# Altium project pca10112.PrjPCB (part 3 of 5)

## Sheet pca10112_sheet6_connectors.SchDoc: Connectors
size A3; Organization: Nordic Semiconductor; DocumentNumber: 5; Revision: 2.0.0; SheetNumber: 5; SheetTotal: 8; Author: MASI; CompanyName: Nordic Semiconductor; ProjectName: pca10112.PrjPCB
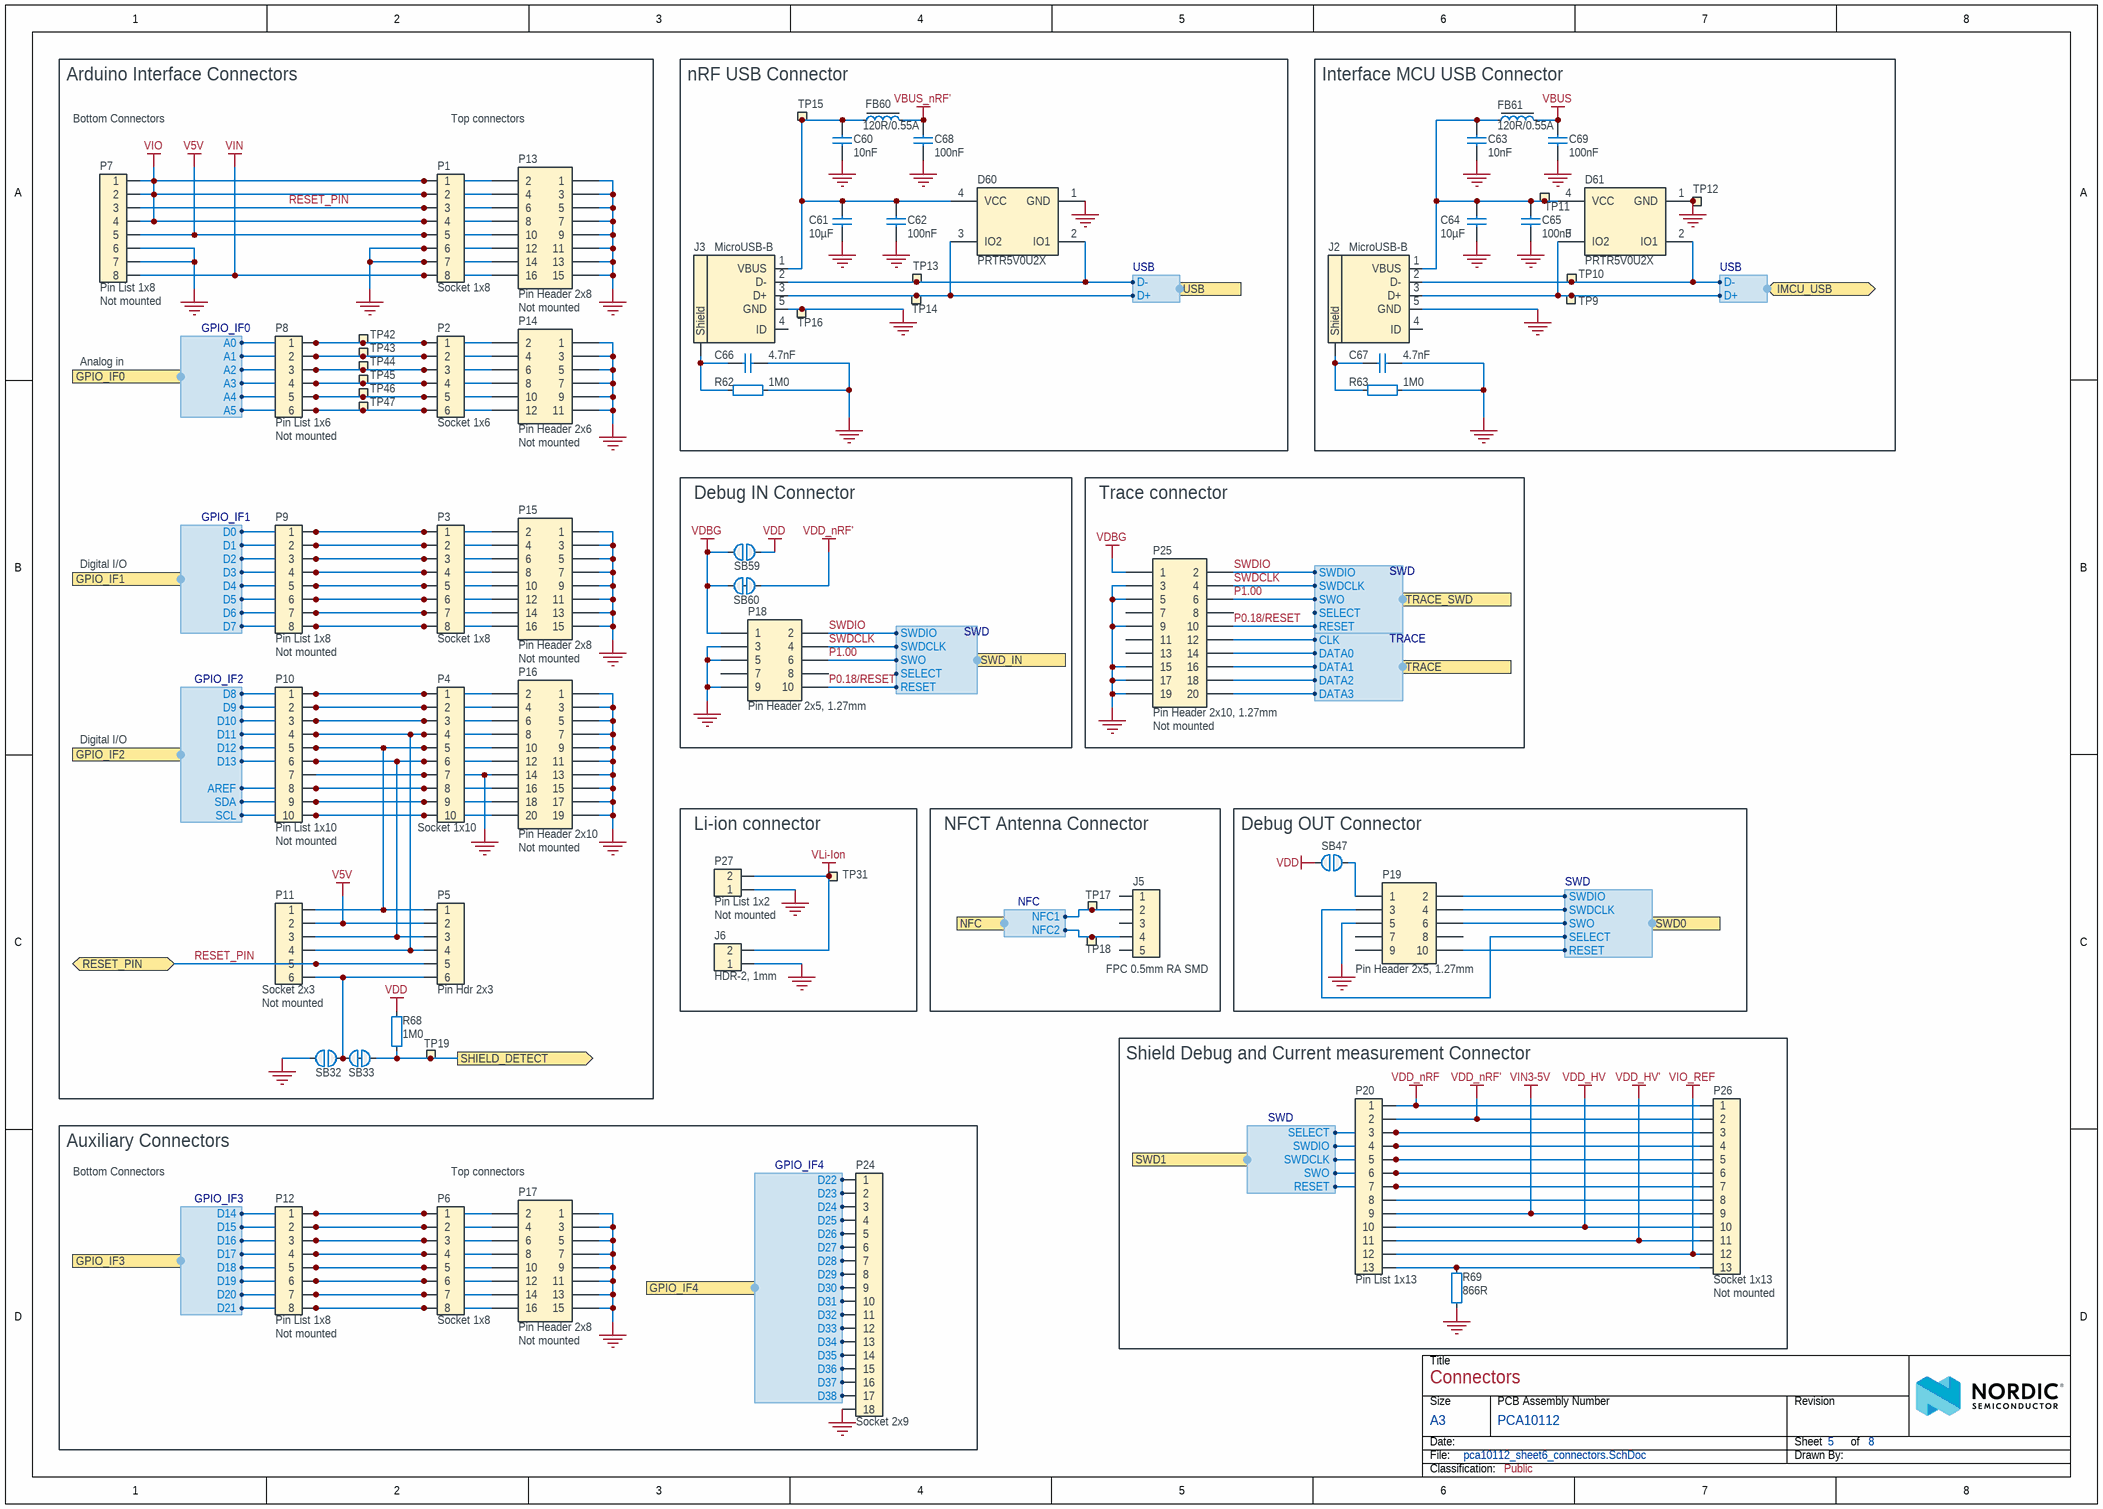
[diagram p4: pca10112_sheet6_connectors.SchDoc]

### Parts
C60  10nF  [CAPC0603X03L_C]
C61  10µF  [CAPC1608X06L]
C62  100nF  [CAPC0603X03L_C]
C63  10nF  [CAPC0603X03L_C]
C64  10µF  [CAPC1608X06L]
C65  100nF  [CAPC0603X03L_C]
C66  4.7nF  [CAPC0603X03L_C]
C67  4.7nF  [CAPC0603X03L_C]
C68  100nF  [CAPC0603X03L_C]
C69  100nF  [CAPC0603X03L_C]
D60  PRTR5V0U2X  [SOT190P230X110-4L]
D61  PRTR5V0U2X  [SOT190P230X110-4L]
FB60  120R/0.55A  [INDC1005X04L]
FB61  120R/0.55A  [INDC1005X04L]
J2  MicroUSB-B  [USB-Micro-B-RA-SMD-PiP]
J3  MicroUSB-B  [USB-Micro-B-RA-SMD-PiP]
J5  FPC 0.5mm RA SMD  [FPC_05P-0.5mm-RA-SMD]
J6  HDR-2, 1mm  [SM02B-SRSS-TB]
P1  Socket 1x8  [SOCKET_1x8_SMD]
P2  Socket 1x6  [SOCKET_1x6_SMD]
P3  Socket 1x8  [SOCKET_1x8_SMD]
P4  Socket 1x10  [SOCKET_1x10_SMD]
P5  Pin Hdr 2x3  [HDR_2x3-SMD]
P6  Socket 1x8  [SOCKET_1x8_SMD]
P7  Pin List 1x8  Assembly: Not mounted  [LIST_1x8_SMD-NC]
P8  Pin List 1x6  Assembly: Not mounted  [LIST_1x6_SMD-NC]
P9  Pin List 1x8  Assembly: Not mounted  [LIST_1x8_SMD-NC]
P10  Pin List 1x10  Assembly: Not mounted  [LIST_1x10_SMD-NC]
P11  Socket 2x3  Assembly: Not mounted  [SOCKET_2x3_SMD-2.54mm-bottom-NC]
P12  Pin List 1x8  Assembly: Not mounted  [LIST_1x8_SMD-NC]
P13  Pin Header 2x8  Assembly: Not mounted  [HDR_2x8-NC]
P14  Pin Header 2x6  Assembly: Not mounted  [HDR_2x6-NC]
P15  Pin Header 2x8  Assembly: Not mounted  [HDR_2x8-NC]
P16  Pin Header 2x10  Assembly: Not mounted  [HDR_2x10-NC]
P17  Pin Header 2x8  Assembly: Not mounted  [HDR_2x8-NC]
P18  Pin Header 2x5, 1.27mm  [HDR_2x5-SMD-1.27mm-K]
P19  Pin Header 2x5, 1.27mm  [HDR_2x5-SMD-1.27mm-K]
P20  Pin List 1x13  [LIST_1x13_SMD]
P24  Socket 2x9  [SOCKET_2x9_SMD-2.54mm]
P25  Pin Header 2x10, 1.27mm  Assembly: Not mounted  [HDR_2x10-SMD-1.27mm-NC]
P26  Socket 1x13  Assembly: Not mounted  [LIST_1x13_SMD-NC]
P27  Pin List 1x2  Assembly: Not mounted  [LIST_1x2-NC]
R62  1M0  [RESC0603X03L_C]
R63  1M0  [RESC0603X03L_C]
R68  1M0  [RESC0603X03L_C]
R69  866R  [RESC0603X03L_C]
SB32  Solderbridge  [Solderbridge]  (value not drawn)  (no BOM)
SB33  Solderbridge  [Solderbridge_Shorted]  (value not drawn)  (net tie, no BOM)
SB47  Solderbridge  [Solderbridge]  (value not drawn)  (no BOM)
SB59  Solderbridge  [Solderbridge]  (value not drawn)  (no BOM)
SB60  Solderbridge  [Solderbridge_Shorted]  (value not drawn)  (net tie, no BOM)
TP9  Ø1.0mm,SMD  [TP_SMD_D1.0mm]  (value not drawn)  (no BOM)
TP10  Ø1.0mm,SMD  [TP_SMD_D1.0mm]  (value not drawn)  (no BOM)
TP11  Ø1.0mm,SMD  [TP_SMD_D1.0mm]  (value not drawn)  (no BOM)
TP12  Ø1.0mm,SMD  [TP_SMD_D1.0mm]  (value not drawn)  (no BOM)
TP13  Ø1.5mm,SMD  [TP_SMD_D1.5mm]  (value not drawn)  (no BOM)
TP14  Ø1.5mm,SMD  [TP_SMD_D1.5mm]  (value not drawn)  (no BOM)
TP15  Ø1.5mm,SMD  [TP_SMD_D1.5mm]  (value not drawn)  (no BOM)
TP16  Ø1.5mm,SMD  [TP_SMD_D1.5mm]  (value not drawn)  (no BOM)
TP17  Ø1.0mm,SMD  [TP_SMD_D1.0mm]  (value not drawn)  (no BOM)
TP18  Ø1.0mm,SMD  [TP_SMD_D1.0mm]  (value not drawn)  (no BOM)
TP19  Ø1.0mm,SMD  [TP_SMD_D1.0mm]  (value not drawn)  (no BOM)
TP31  Ø1.0mm,SMD  [TP_SMD_D1.0mm]  (value not drawn)  (no BOM)
TP42  Ø1.0mm,SMD  [TP_SMD_D1.0mm]  (value not drawn)  (no BOM)
TP43  Ø1.0mm,SMD  [TP_SMD_D1.0mm]  (value not drawn)  (no BOM)
TP44  Ø1.0mm,SMD  [TP_SMD_D1.0mm]  (value not drawn)  (no BOM)
TP45  Ø1.0mm,SMD  [TP_SMD_D1.0mm]  (value not drawn)  (no BOM)
TP46  Ø1.0mm,SMD  [TP_SMD_D1.0mm]  (value not drawn)  (no BOM)
TP47  Ø1.0mm,SMD  [TP_SMD_D1.0mm]  (value not drawn)  (no BOM)

### Blocks framed on the sheet
Arduino Interface Connectors: P1-P5 P7-P11 P13-P16 R68 SB32 SB33 TP19 TP42-TP47
nRF USB Connector: C60-C62 C66 C68 D60 FB60 J3 R62 TP13-TP16
Interface MCU USB Connector: C63-C65 C67 C69 D61 FB61 J2 R63 TP9-TP12
Debug IN Connector: P18 SB59 SB60
Trace connector: P25
Li-ion connector: J6 P27 TP31
NFCT Antenna Connector: J5 TP17 TP18
Debug OUT Connector: P19 SB47
Shield Debug and Current measurement Connector: P20 P26 R69
Auxiliary Connectors: P6 P12 P17 P24

### Ports
GPIO_IF0 (harness GPIO_IF0), GPIO_IF1 (harness GPIO_IF1), GPIO_IF2 (harness GPIO_IF2), GPIO_IF3 (harness GPIO_IF3), GPIO_IF4 (harness GPIO_IF4), IMCU_USB (bidir, harness USB), NFC (harness NFC), RESET_PIN (bidir), SHIELD_DETECT (out), SWD0 (harness SWD), SWD1 (harness SWD), SWD_IN (harness SWD), TRACE (harness TRACE), TRACE_SWD (harness SWD), USB (harness USB)

### Harnesses
GPIO_IF0: A0, A1, A2, A3, A4, A5
GPIO_IF1: D0, D1, D2, D3, D4, D5, D6, D7
GPIO_IF2: D8, D9, D10, D11, D12, D13, AREF, SDA, SCL
GPIO_IF3: D14, D15, D16, D17, D18, D19, D20, D21
GPIO_IF4: D22, D23, D24, D25, D26, D27, D28, D29, D30, D31, D32, D33, D34, D35, D36, D37, D38
SWD: SWDIO, SWDCLK, SWO, RESET, SELECT
NFC: NFC2, NFC1
TRACE: CLK, DATA0, DATA1, DATA3, DATA2
USB: D-, D+
USB: D+, D-

### Nets
GND: C60.1 C61.1 C62.1 C63.2 C64.1 C65.1 C66.1 C67.1 C68.1 C69.1 D60.1(GND) D61.1(GND) J2.5(GND) J3.5(GND) J6.1 P1.6 P1.7 P4.7 P7.6 P7.7 P10.7 P13.1 P13.3 P13.5 P13.7 P13.9 P13.11 P13.12 P13.13 P13.14 P13.15 P14.1 P14.3 P14.5 P14.7 P14.9 P14.11 P15.1 P15.3 P15.5 P15.7 P15.9 P15.11 P15.13 P15.15 P16.1 P16.3 P16.5 P16.7 P16.9 P16.11 P16.13 P16.14 P16.15 P16.17 P16.19 P17.1 P17.3 P17.5 P17.7 P17.9 P17.11 P17.13 P17.15 P18.3 P18.5 P18.9 P19.5 P24.18 P25.3 P25.5 P25.9 P25.15 P25.17 P25.19 P27.1 R62.1 R63.1 R69.1 SB32.1 TP12.1 TP16.1
V5V: P1.5 P5.2 P7.5 P11.2 P13.10
VBUS: C69.2 FB61.2
VBUS_nRF': C68.2 FB60.2
VDBG: P18.1 P25.1 SB59.1 SB60.1
VDD: R68.2 SB47.1 SB59.2
VDD_HV: P20.10 P26.10
VDD_HV': P20.11 P26.11
VDD_nRF: P20.1 P26.1
VDD_nRF': P20.2 P26.2 SB60.2
VIN: P1.8 P7.8 P13.16
VIN3-5V: P20.9 P26.9
VIO: P1.1 P1.2 P1.4 P7.1 P7.2 P7.4 P13.2 P13.4 P13.8
VIO_REF: P20.12 P26.12
VLi-Ion: J6.2 P27.2 TP31.1
D20: P6.7 P12.7 P17.14 ; port GPIO_IF3.D20
D21: P6.8 P12.8 P17.16 ; port GPIO_IF3.D21
D_N: D60.2(IO1) J3.2(D-) TP13.1 ; port USB.D-
D_P: D60.3(IO2) J3.3(D+) TP14.1 ; port USB.D+
IMCU_N: D61.2(IO1) J2.2(D-) TP10.1 ; port IMCU_USB.D-
IMCU_P: D61.3(IO2) J2.3(D+) TP9.1 ; port IMCU_USB.D+
NFC1: J5.2 TP17.1 ; port NFC.NFC1
NFC2: J5.4 TP18.1 ; port NFC.NFC2
P0.00: P6.1 P12.1 P17.2 ; port GPIO_IF3.D14
P0.01: P6.2 P12.2 P17.4 ; port GPIO_IF3.D15
P0.02/AIN0: P4.8 P10.8 P16.16 ; port GPIO_IF2.AREF
P0.03/AIN1: P2.1 P8.1 P14.2 TP42.1 ; port GPIO_IF0.A0
P0.04/AIN2: P2.2 P8.2 P14.4 TP43.1 ; port GPIO_IF0.A1
P0.05/AIN3: P6.3 P12.3 P17.6 ; port GPIO_IF3.D16
P0.06: P6.4 P12.4 P17.8 ; port GPIO_IF3.D17
P0.07: P6.5 P12.5 P17.10 P25.12 ; port GPIO_IF3.D18, port TRACE.CLK
P0.08: P6.6 P12.6 P17.12 ; port GPIO_IF3.D19
P0.11: P24.1 P25.18 ; port GPIO_IF4.D22, port TRACE.DATA2
P0.12: P24.2 P25.16 ; port GPIO_IF4.D23, port TRACE.DATA1
P0.13: P24.3 ; port GPIO_IF4.D24
P0.14: P24.4 ; port GPIO_IF4.D25
P0.15: P24.5 ; port GPIO_IF4.D26
P0.16: P24.6 ; port GPIO_IF4.D27
P0.17: P24.7 ; port GPIO_IF4.D28
P0.18/RESET: P18.10 P24.8 P25.10 ; port GPIO_IF4.D29, port TRACE_SWD.RESET
P0.19: P24.9 ; port GPIO_IF4.D30
P0.20: P24.10 ; port GPIO_IF4.D31
P0.21: P24.11 ; port GPIO_IF4.D32
P0.22: P24.12 ; port GPIO_IF4.D33
P0.23: P24.13 ; port GPIO_IF4.D34
P0.24: P24.14 ; port GPIO_IF4.D35
P0.25: P24.15 ; port GPIO_IF4.D36
P0.28/AIN4: P2.3 P8.3 P14.6 TP44.1 ; port GPIO_IF0.A2
P0.29/AIN5: P2.4 P8.4 P14.8 TP45.1 ; port GPIO_IF0.A3
P0.30/AIN6: P2.5 P8.5 P14.10 TP46.1 ; port GPIO_IF0.A4
P0.31/AIN7: P2.6 P8.6 P14.12 TP47.1 ; port GPIO_IF0.A5
P1.00: P18.6 P24.16 P25.6 P25.14 ; port GPIO_IF4.D37, port TRACE_SWD.SWO, port TRACE.DATA0
P1.01: P3.1 P9.1 P15.2 ; port GPIO_IF1.D0
P1.02: P3.2 P9.2 P15.4 ; port GPIO_IF1.D1
P1.03: P3.3 P9.3 P15.6 ; port GPIO_IF1.D2
P1.04: P3.4 P9.4 P15.8 ; port GPIO_IF1.D3
P1.05: P3.5 P9.5 P15.10 ; port GPIO_IF1.D4
P1.06: P3.6 P9.6 P15.12 ; port GPIO_IF1.D5
P1.07: P3.7 P9.7 P15.14 ; port GPIO_IF1.D6
P1.08: P3.8 P9.8 P15.16 ; port GPIO_IF1.D7
P1.09: P24.17 P25.20 ; port GPIO_IF4.D38, port TRACE.DATA3
P1.10: P4.1 P10.1 P16.2 ; port GPIO_IF2.D8
P1.11: P4.2 P10.2 P16.4 ; port GPIO_IF2.D9
P1.12: P4.3 P10.3 P16.6 ; port GPIO_IF2.D10
P1.13: P4.4 P5.4 P10.4 P11.4 P16.8 ; port GPIO_IF2.D11
P1.14: P4.5 P5.1 P10.5 P11.1 P16.10 ; port GPIO_IF2.D12
P1.15: P4.6 P5.3 P10.6 P11.3 P16.12 ; port GPIO_IF2.D13
RESET_PIN: P1.3 P5.5 P7.3 P11.5 P13.6 ; port RESET_PIN
SCL: P4.10 P10.10 P16.20 ; port GPIO_IF2.SCL
SDA: P4.9 P10.9 P16.18 ; port GPIO_IF2.SDA
SHIELD_DETECT: R68.1 SB33.2 TP19.1 ; port SHIELD_DETECT
SWD0_SEL: P19.3 ; port SWD0.SELECT
SWDCLK: P18.4 P25.4 ; port TRACE_SWD.SWDCLK
SWDIO: P18.2 P25.2 ; port TRACE_SWD.SWDIO
NetC60_2: C60.2 C61.2 C62.2 D60.4(VCC) FB60.1 J3.1(VBUS) TP15.1
NetC63_1: C63.1 C64.2 C65.2 D61.4(VCC) FB61.1 J2.1(VBUS) TP11.1
NetC66_2: C66.2 J3.6(Shield) R62.2
NetC67_2: C67.2 J2.6(Shield) R63.2
NetP5_6: P5.6 P11.6 SB32.2 SB33.1
NetP19_1: P19.1 SB47.2
NetP19_2: P19.2 ; port SWD0.SWDIO
NetP19_4: P19.4 ; port SWD0.SWDCLK
NetP19_6: P19.6 ; port SWD0.SWO
NetP19_10: P19.10 ; port SWD0.RESET
NetP20_3: P20.3 P26.3 ; port SWD1.SELECT
NetP20_4: P20.4 P26.4 ; port SWD1.SWDIO
NetP20_5: P20.5 P26.5 ; port SWD1.SWDCLK
NetP20_6: P20.6 P26.6 ; port SWD1.SWO
NetP20_7: P20.7 P26.7 ; port SWD1.RESET
NetP20_8: P20.8 P26.8
NetP20_13: P20.13 P26.13 R69.2

Not connected (* = marked no-connect by the designer): J2 4(ID); J3 4(ID); J5 1 3 5; P18 7 8; P19 7 8 9; P25 7 8 11 13

### Notes on the sheet
- Bottom Connectors
- Top connectors
- Analog in
- Digital I/O
- Title
- Size
- Date:
- File:
- A3
- PCB Assembly Number
- Sheet         of
- Drawn By:
- Revision
- Classification:

### Library data of the parts
C60 C63 = C0201-10n: Capacitor, X7R, ±10%; Manufacturer: N.A.; Part number IPS: 00000003480; Part number Norautron: 26621779; Part number NEMS: 100200067; Note: 10V; Pad Count: 2; Component Status: Active; Part Number: C0201-10n; Manufacturer Part Number: N.A.; LatestRevisionDate: 2017-11-09; Published: 2014-11-13; Value: 10nF; Artikkelnr Noca: N.A.; Footprint Doc: 0201; ComponentLink1URL: N.A.; ComponentLink1Description: Datasheet; ComponentLink2URL: N.A.; ComponentLink2Description: Supplier link; HelpURL: N.A.; Supplier 1: N.A.; Supplier Part Number 1: N.A.; Supplier 2: N.A.; Supplier Part Number 2: N.A.; Component Class: Capacitors; PartId: 100200067; Author: rsk
C61 C64 = C0603-10µ: Capacitor, X5R, ±20%; Manufacturer: N.A.; Part number IPS: 00000007785; Part number NEMS: 100200275; Note: 6.3V; Artikkelnr Noca: 20039234; Pad Count: 2; Component Status: Active; Part Number: C0603-10µ; Manufacturer Part Number: N.A.; LatestRevisionDate: 2011-01-17; Published: 2011-01-17; Value: 10µF; Footprint Doc: 0603; ComponentLink1URL: N.A.; ComponentLink1Description: Datasheet; ComponentLink2URL: N.A.; ComponentLink2Description: Supplier link; HelpURL: N.A.; Supplier 1: N.A.; Supplier Part Number 1: N.A.; Supplier 2: N.A.; Supplier Part Number 2: N.A.; Component Class: Capacitors; PartId: 100200275; Author: rsk; Part number Norautron: N.A.
C62 C65 C68 C69 = C0201-100n: Capacitor, X5R, ±10%; Manufacturer: N.A.; Part number IPS: 00000001248, 00000002505; Part number Norautron: 262071862; Part number NEMS: 100200078; Note: 16V; Pad Count: 2; Component Status: Active; Part Number: C0201-100n; Manufacturer Part Number: N.A.; LatestRevisionDate: 2017-11-09; Published: 2014-11-13; Value: 100nF; Artikkelnr Noca: N.A.; Footprint Doc: 0201; ComponentLink1URL: N.A.; ComponentLink1Description: Datasheet; ComponentLink2URL: N.A.; ComponentLink2Description: Supplier link; HelpURL: N.A.; Supplier 1: N.A.; Supplier Part Number 1: N.A.; Supplier 2: N.A.; Supplier Part Number 2: N.A.; Component Class: Capacitors; PartId: 100200078; Author: rsk
C66 C67 = C0201-4n7: Capacitor, X7R, ±10%, 10V; Manufacturer: N.A.; Part number IPS: 00000001243; Part number NEMS: 100200063; Note: Chip Cap 1%; Pad Count: 2; Component Status: Active; Part Number: C0201-4n7; Manufacturer Part Number: N.A.; LatestRevisionDate: 2020-10-13; Published: 2014-11-13; Value: 4.7nF; Artikkelnr Noca: N.A.; Footprint Doc: 0201; ComponentLink1URL: N.A.; ComponentLink1Description: Datasheet; ComponentLink2URL: N.A.; ComponentLink2Description: Supplier link; HelpURL: N.A.; Supplier 1: N.A.; Supplier Part Number 1: N.A.; Supplier 2: N.A.; Supplier Part Number 2: N.A.; Component Class: Capacitors; PartId: 100200063; Author: rsk; Part number Norautron: N.A.
D60 D61 = PRTR5V0U2X: Ultra low capacitance double rail-to-rail ESD protection diode; Manufacturer: NXP Semiconductors; Part number IPS: 00000009951; Part number Norautron: 26313940; Part number NEMS: 101300082; Note: N.A.; Artikkelnr Noca: 10069015; Pad Count: 4; Component Status: Active; Part Number: PRTR5V0U2X; Manufacturer Part Number: PRTR5V0U2X; LatestRevisionDate: 2017-11-09; Published: 2012-06-11; Value: PRTR5V0U2X; Footprint Doc: SOT-143B; ComponentLink1URL: N.A.; ComponentLink1Description: Datasheet; ComponentLink2URL: N.A.; ComponentLink2Description: Supplier link; HelpURL: http://www.farnell.com/datasheets/109718.pdf; Supplier 1: Digi-Key; Supplier Part Number 1: 568-4140-1-ND; Supplier 2: Farnell; Supplier Part Number 2: 152-4157; Component Class: Semiconductors; PartId: 101300082; Author: rsk
FB60 FB61 = FB0402-120R@100M-500mA: Ferrite Bead, 120 Ohm @ 100MHz, 500mA, 250 mOhm Max; Manufacturer: Murata; Manufacturer Part Number: BLM15AG121SN1D; Part number IPS: 00000009954; Part number Norautron: 265230631; Part number NEMS: 100300099; Note: Chip EMIFIL Inductor Type Chip Ferrite Bead; Artikkelnr Noca: 33029317; Pad Count: 2; Component Status: Active; Part Number: FB0402-120R@100M-500mA; Footprint Doc: 0402; LatestRevisionDate: 2014-01-10; Published: 2011-11-14; Value: 120R/0.55A; ComponentLink1Description: Datasheet; ComponentLink2Description: Supplier link; ComponentLink1URL: N.A.; ComponentLink2URL: N.A.; HelpURL: http://search.murata.co.jp/Ceramy/image/img/PDF/ENG/L0110S0100BLM15A_SN.pdf; Supplier 1: Digi-Key; Supplier Part Number 1: 490-1005-1-ND; Supplier 2: Farnell; Supplier Part Number 2: 151-5760; Component Class: Inductors; PartId: 100300099; Author: rsk
J2 J3 = USB-Micro-B-RA-SMD-PiP: MicroUSB-B-SMT; Manufacturer: Allen Creations Corp.; Manufacturer Part Number: AJU55-BS2111-L; Part number IPS: 00000007790; Part number NEMS: 100500490; Note: N.A.; Artikkelnr Noca: 55029020; Pad Count: 5; Component Status: Active; Part Number: USB-Micro-B-RA-SMD-PiP; Footprint Doc: USB-Micro-B-RA-SMD-PiP; LatestRevisionDate: 2016-04-21; Published: 2014-10-07; Value: MicroUSB-B; ComponentLink1URL: N.A.; ComponentLink1Description: Datasheet; ComponentLink2URL: N.A.; ComponentLink2Description: Supplier link; HelpURL: \\hizz\pro\app9717\Datasheet\connectors\Allen Creations Corp\AJU-211.pdf; Supplier 1: Cabcon; Supplier Part Number 1: AJU55-BS2111-L; Supplier 2: Digi-Key; Supplier Part Number 2: 609-4616-1-ND; Component Class: Connectors; PartId: 100500490; Author: rsk; Part number Norautron: N.A.
J5 = FPC_05P-0.5mm-RA-SMD: 0.5mm FPC, 5P,Right Angle SMT,Double Contact,H=1.2mm,White, Tin plated; Manufacturer: W-CON; Manufacturer Part Number: 5141-05RZDNWR02; Part number IPS: 00000007792; Part number Norautron: 26032377; Part number NEMS: 100500528; Note: N.A.; Artikkelnr Noca: 55010020; Pad Count: 7; Component Status: Active; Part Number: FPC_05P-0.5mm-RA-SMD; Footprint Doc: FPC_05P-0.5mm-RA-SMD; LatestRevisionDate: 2021-09-24; Published: 2015-06-22; Value: FPC 0.5mm RA SMD; ComponentLink1URL: N.A.; ComponentLink1Description: Datasheet; ComponentLink2URL: N.A.; ComponentLink2Description: Supplier link; HelpURL: \\hizz\pro\app9717\Datasheet\connectors\W-CON\5141-05RZDNXX02.pdf; Supplier 1: Cabcon; Supplier Part Number 1: 5141-05RZDNWR02; Supplier 2: Digi-Key; Supplier Part Number 2: WM9836CT-ND; Component Class: Connectors; PartId: 100500528; Author: rsk
J6 = SM02B-SRSS-TB: 1.0mm pitch connector side entry SMD; Manufacturer: JST Sales America Inc.; Manufacturer Part Number: SM02B-SRSS-TB(LF)(SN); Part number IPS: 00000007791; Part number Norautron: N.A.; Part number NEMS: 100500383; Note: JST, Header; Artikkelnr Noca: 55010030; Pad Count: 2; Component Status: Active; Part Number: SM02B-SRSS-TB; Footprint Doc: SM02B-SRSS-TB; LatestRevisionDate: 2016-06-20; Published: 2016-06-20; Value: HDR-2, 1mm; ComponentLink1URL: N.A.; ComponentLink1Description: Datasheet; ComponentLink2URL: N.A.; ComponentLink2Description: Supplier link; HelpURL: http://www.jst-mfg.com/product/pdf/eng/eSH.pdf; Supplier 1: Cabcon; Supplier Part Number 1: SM02B-SRSS-TB(LF)(SN); Supplier 2: Digi-Key; Supplier Part Number 2: 455-1802-1-ND; Component Class: Connectors; PartId: 100500383; Author: rsk
P1 P3 P6 = Socket 1x8 SMD: Socket 1x8, 2.54mm (100mil), SMD; Manufacturer: W-CON; Manufacturer Part Number: 2171-108MS0CUNR1; Part number IPS: 00000009963; Part number Norautron: 26032369; Part number NEMS: 100500412; Note: N.A.; Artikkelnr Noca: 55030002; Pad Count: 8; Component Status: Active; Part Number: Socket 1x8 SMD; Footprint Doc: SOCKET_1x8_SMD; LatestRevisionDate: 2017-10-23; Published: 2016-01-22; Value: Socket 1x8; ComponentLink1URL: N.A.; ComponentLink1Description: Datasheet; ComponentLink2URL: N.A.; ComponentLink2Description: Supplier link; HelpURL: N.A.; Supplier 1: Cabcon; Supplier Part Number 1: 2171-108MS0CUNR1; Supplier 2: Samtec; Supplier Part Number 2: SSM-108-F-SV-P-TR; Component Class: Connectors; PartId: 100500412; Author: rsk
P2 = Socket 1x6 SMD: Socket 1x6, 2.54mm (100mil), SMD; Manufacturer: W-CON; Manufacturer Part Number: 2171-106MS0CUNR1; Part number IPS: 00000009964; Part number Norautron: 26032370; Part number NEMS: 100500408; Note: N.A.; Artikkelnr Noca: 55030001; Pad Count: 6; Component Status: Active; Part Number: Socket 1x6 SMD; Footprint Doc: SOCKET_1x6_SMD; LatestRevisionDate: 2017-10-23; Published: 2016-01-22; Value: Socket 1x6; ComponentLink1URL: N.A.; ComponentLink1Description: Datasheet; ComponentLink2URL: N.A.; ComponentLink2Description: Supplier link; HelpURL: N.A.; Supplier 1: Cabcon; Supplier Part Number 1: 2171-106MS0CUNR1; Supplier 2: Samtec; Supplier Part Number 2: SSM-106-F-SV-P-TR; Component Class: Connectors; PartId: 100500408; Author: rsk
P4 = Socket 1x10 SMD: Socket 1x10, 2.54mm (100mil), SMD; Manufacturer: W-CON; Manufacturer Part Number: 2171-110MS0CUNR1; Part number IPS: 00000009965; Part number Norautron: 26032371; Part number NEMS: 100500416; Note: N.A.; Artikkelnr Noca: 55030004; Pad Count: 10; Component Status: Active; Part Number: Socket 1x10 SMD; Footprint Doc: SOCKET_1x10_SMD; LatestRevisionDate: 2016-01-22; Published: 2016-01-22; Value: Socket 1x10; ComponentLink1URL: N.A.; ComponentLink1Description: Datasheet; ComponentLink2URL: N.A.; ComponentLink2Description: Supplier link; HelpURL: N.A.; Supplier 1: Cabcon; Supplier Part Number 1: 2171-110MS0CUNR1; Supplier 2: Samtec; Supplier Part Number 2: SSM-110-F-SV-P-TR; Component Class: Connectors; PartId: 100500416; Author: rsk
P5 = Pin Header 2x3 SMD: Pin Header 2x3, 2.54mm (100mil) SMD; Manufacturer: W-CON; Manufacturer Part Number: 1125-1203S0M116R1; Part number IPS: 00000009966; Part number Norautron: N.A.; Part number NEMS: 100500242; Artikkelnr Noca: 55010007; Pad Count: 6; Component Status: Active; Part Number: Pin Header 2x3 SMD; Footprint Doc: HDR_2x3-SMD; LatestRevisionDate: 2016-01-22; Published: 2016-01-22; Value: Pin Hdr 2x3; Note: SMD; ComponentLink1URL: N.A.; ComponentLink1Description: Datasheet; ComponentLink2URL: N.A.; ComponentLink2Description: Supplier link; HelpURL: \\hizz\pro\app9717\Datasheet\connectors\W-CON\1125-12XXXXMXXXXX.PDF; Supplier 1: Cabcon; Supplier Part Number 1: 1125-1203S0M116R1; Supplier 2: Samtec; Supplier Part Number 2: TSM-103-01-L-DV; Component Class: Connectors; PartId: 100500242; Author: rsk
P7 P9 P12 = Pin List 1x8 SMD, N.C.: Pin List 1x8, 2.54mm (100mil), SMD; Manufacturer: W-CON; Manufacturer Part Number: 1125-1108S0M116R2; Part number NEMS: 100500330; Note: N.A.; Artikkelnr Noca: 55010006; Pad Count: 8; Component Status: Active; Part Number: Pin List 1x8 SMD, N.C.; LatestRevisionDate: 2016-01-22; Published: 2016-01-22; Value: Pin List 1x8; Footprint Doc: LIST_1x8_SMD; Part number IPS: N.A.; ComponentLink1URL: N.A.; ComponentLink1Description: Datasheet; ComponentLink2URL: N.A.; ComponentLink2Description: Supplier link; HelpURL: \\hizz\pro\app9717\Datasheet\connectors\W-CON\1125-11XXXXMXXXXX.pdf; Supplier 1: Cabcon; Supplier Part Number 1: 1125-1108S0M116R2; Supplier 2: Samtec; Supplier Part Number 2: TSM-108-01-L-SV-P-TR; Component Class: Connectors; PartId: 100500330; Author: rsk; Part number Norautron: N.A.
P8 = Pin List 1x6 SMD, N.C.: Pin List 1x6, 2.54mm (100mil), SMD; Manufacturer: W-CON; Manufacturer Part Number: 1125-1106S0M116R2; Part number NEMS: 100500321; Note: N.A.; Artikkelnr Noca: 55010026; Pad Count: 6; Component Status: Active; Part Number: Pin List 1x6 SMD, N.C.; LatestRevisionDate: 2016-03-29; Published: 2016-03-29; Value: Pin List 1x6; Footprint Doc: LIST_1x6_SMD; Part number IPS: N.A.; ComponentLink1URL: N.A.; ComponentLink1Description: Datasheet; ComponentLink2URL: N.A.; ComponentLink2Description: Supplier link; HelpURL: \\hizz\pro\app9717\Datasheet\connectors\W-CON\1125-11XXXXMXXXXX.pdf; Supplier 1: Cabcon; Supplier Part Number 1: 1125-1106S0M116R2; Supplier 2: Samtec; Supplier Part Number 2: TSM-106-01-L-SV-P-TR; Component Class: Connectors; PartId: 100500321; Author: rsk; Part number Norautron: N.A.
P10 = Pin List 1x10 SMD, N.C.: Pin List 1x10, 2.54mm (100mil), SMD; Manufacturer: W-CON; Manufacturer Part Number: 1125-1110S0M116R2; Part number NEMS: 100500338; Note: N.A.; Artikkelnr Noca: 55010028; Pad Count: 10; Component Status: Active; Part Number: Pin List 1x10 SMD, N.C.; LatestRevisionDate: 2016-03-29; Published: 2016-03-29; Value: Pin List 1x10; Footprint Doc: LIST_1x10_SMD; Part number IPS: N.A.; ComponentLink1URL: N.A.; ComponentLink1Description: Datasheet; ComponentLink2URL: N.A.; ComponentLink2Description: Supplier link; HelpURL: \\hizz\pro\app9717\Datasheet\connectors\W-CON\1125-11XXXXMXXXXX.pdf; Supplier 1: Cabcon; Supplier Part Number 1: 1125-1110S0M116R2; Supplier 2: Samtec; Supplier Part Number 2: TSM-110-01-L-SV-P-TR; Component Class: Connectors; PartId: 100500338; Author: rsk; Part number Norautron: N.A.
P11 = Socket 2x3 SMD Bottom, N.C.: Socket 2x3, 2.54mm (100mil), SMD; Manufacturer: W-CON; Manufacturer Part Number: 2171-203MS0CUNR1; Part number NEMS: 100500434; Note: N.A.; Artikkelnr Noca: 55030010; Pad Count: 6; Component Status: Active; Part Number: Socket 2x3 SMD Bottom, N.C.; LatestRevisionDate: 2016-03-29; Published: 2014-06-10; Value: Socket 2x3; Footprint Doc: SOCKET_2x3_SMD-2.54mm-bottom; Part number IPS: N.A.; ComponentLink1URL: N.A.; ComponentLink1Description: Datasheet; ComponentLink2URL: N.A.; ComponentLink2Description: Supplier link; HelpURL: \\hizz\pro\app9717\Datasheet\connectors\W-CON\2171-2XXMXXCUNXX.pdf; Supplier 1: Cabcon; Supplier Part Number 1: 2171-203MS0CUNR1; Supplier 2: Samtec; Supplier Part Number 2: SSM-103-F-DV-P-TR; Component Class: Connectors; PartId: 100500434; Author: rsk; Part number Norautron: N.A.
P13 P15 P17 = Pin Header 2x8, N.C.: Pin Header 2x8, 2.54mm (100mil); Manufacturer: N.A.; Part number NEMS: 100500270; Pad Count: 16; Component Status: Active; Part Number: Pin Header 2x8, N.C.; Manufacturer Part Number: N.A.; Footprint Doc: HDR_2x8; LatestRevisionDate: 2009-12-12; Published: 2009-12-12; Value: Pin Header 2x8; Note: N.A.; Artikkelnr Noca: N.A.; Part number IPS: N.A.; ComponentLink1URL: N.A.; ComponentLink1Description: Datasheet; ComponentLink2URL: N.A.; ComponentLink2Description: Supplier link; HelpURL: N.A.; Supplier 1: N.A.; Supplier Part Number 1: N.A.; Supplier 2: N.A.; Supplier Part Number 2: N.A.; Component Class: Connectors; PartId: 100500270; Author: rsk; Part number Norautron: N.A.
P14 = Pin Header 2x6, N.C.: Pin Header 2x6, 2.54mm (100mil); Manufacturer: N.A.; Part number NEMS: 100500265; Pad Count: 12; Component Status: Active; Part Number: Pin Header 2x6, N.C.; Manufacturer Part Number: N.A.; Footprint Doc: HDR_2x6; LatestRevisionDate: 2014-07-04; Published: 2009-12-12; Value: Pin Header 2x6; Note: N.A.; Artikkelnr Noca: N.A.; Part number IPS: N.A.; ComponentLink1URL: N.A.; ComponentLink1Description: Datasheet; ComponentLink2URL: N.A.; ComponentLink2Description: Supplier link; HelpURL: N.A.; Supplier 1: N.A.; Supplier Part Number 1: N.A.; Supplier 2: N.A.; Supplier Part Number 2: N.A.; Component Class: Connectors; PartId: 100500265; Author: rsk; Part number Norautron: N.A.
P16 = Pin Header 2x10, N.C.: Pin Header 2x10, 2.54mm (100mil); Manufacturer: N.A.; Part number NEMS: 100500274; Pad Count: 20; Component Status: Active; Part Number: Pin Header 2x10, N.C.; Manufacturer Part Number: N.A.; Footprint Doc: HDR_2x10; LatestRevisionDate: 2017-02-02; Published: 2017-01-30; Value: Pin Header 2x10; Note: N.A.; Artikkelnr Noca: N.A.; Part number IPS: N.A.; ComponentLink1URL: N.A.; ComponentLink1Description: Datasheet; ComponentLink2URL: N.A.; ComponentLink2Description: Supplier link; HelpURL: N.A.; Supplier 1: N.A.; Supplier Part Number 1: N.A.; Supplier 2: N.A.; Supplier Part Number 2: N.A.; Component Class: Connectors; PartId: 100500274; Author: rsk; Part number Norautron: N.A.
P18 P19 = Pin Header 2x5 SMD, 1.27mm, KS: Pin Header 2x5, 1.27mm (50mil), SMD, Keying Shroud; Manufacturer: W-CON; Manufacturer Part Number: 3132-10MS0BK00R1; Part number IPS: 00000009968; Part number NEMS: 100500261; Note: N.A.; Artikkelnr Noca: 55010009; Pad Count: 10; Component Status: Active; Part Number: Pin Header 2x5 SMD, 1.27mm, KS; Footprint Doc: HDR_2x5-SMD-1.27mm; LatestRevisionDate: 2016-04-21; Published: 2016-01-22; Value: Pin Header 2x5, 1.27mm; ComponentLink1URL: N.A.; ComponentLink1Description: Datasheet; ComponentLink2URL: N.A.; ComponentLink2Description: Supplier link; HelpURL: \\hizz\pro\app9717\Datasheet\connectors\W-CON\3132-XXMXXBK00XX.pdf; Supplier 1: Cabcon; Supplier Part Number 1: 3132-10MS0BK00R1; Supplier 2: Samtec; Supplier Part Number 2: FTSH-105-01-F-DV-K; Component Class: Connectors; PartId: 100500261; Author: rsk; Part number Norautron: N.A.
P20 = Pin List 1x13 SMD: Pin List 1x13, 2.54mm (100mil), SMD; Manufacturer: N.A.; Part number IPS: 00000002499; Part number NEMS: 100500345; Pad Count: 13; Component Status: Active; Part Number: Pin List 1x13 SMD; Manufacturer Part Number: N.A.; Footprint Doc: LIST_1x13_SMD; LatestRevisionDate: 2015-11-10; Published: 2015-11-10; Value: Pin List 1x13; Note: N.A.; Artikkelnr Noca: N.A.; ComponentLink1URL: N.A.; ComponentLink1Description: Datasheet; ComponentLink2URL: N.A.; ComponentLink2Description: Supplier link; HelpURL: N.A.; Supplier 1: Cabcon; Supplier Part Number 1: 1125-1113S0M116R2; Supplier 2: Samtec; Supplier Part Number 2: TSM-113-01-L-SV-P-TR; Component Class: Connectors; PartId: 100500345; Author: rsk; Part number Norautron: N.A.
P24 = Socket 2x9 SMD: Socket 2x9, 2.54mm (100mil), SMD; Manufacturer: W-CON; Manufacturer Part Number: 2171-209MS0CUNR1; Part number IPS: 00000004367; Part number NEMS: 100500440; Note: N.A.; Artikkelnr Noca: 55030011; Pad Count: 18; Component Status: Active; Part Number: Socket 2x9 SMD; Footprint Doc: SOCKET_2x9_SMD-2.54mm; LatestRevisionDate: 2017-10-23; Published: 2016-07-07; Value: Socket 2x9; ComponentLink1URL: N.A.; ComponentLink1Description: Datasheet; ComponentLink2URL: N.A.; ComponentLink2Description: Supplier link; HelpURL: N.A.; Supplier 1: Cabcon; Supplier Part Number 1: 2171-209MS0CUNR1; Supplier 2: Samtec; Supplier Part Number 2: SSM-109-F-DV-P-TR; Component Class: Connectors; PartId: 100500440; Author: rsk; Part number Norautron: N.A.
P25 = Pin Header 2x10 SMD, 1.27mm, KS, N.C.: Pin Header 2x10, 1.27mm (50mil), SMD, Keying Shroud; Manufacturer: W-CON; Manufacturer Part Number: 3132-20MS0BK00R1; Part number NEMS: 100500279; Note: N.A.; Pad Count: 20; Component Status: Active; Part Number: Pin Header 2x10 SMD, 1.27mm, KS, N.C.; LatestRevisionDate: 2017-10-23; Published: 2017-09-07; Value: Pin Header 2x10, 1.27mm; Artikkelnr Noca: N.A.; Footprint Doc: HDR_2x10-SMD-1.27mm; Part number IPS: N.A.; ComponentLink1URL: N.A.; ComponentLink1Description: Datasheet; ComponentLink2URL: N.A.; ComponentLink2Description: Supplier link; HelpURL: N.A.; Supplier 1: Cabcon; Supplier Part Number 1: 3132-20MS0BK00R1; Supplier 2: Digi-Key; Supplier Part Number 2: FTSH-110-01-F-DV-K-ND; Component Class: Connectors; PartId: 100500279; Author: rsk; Part number Norautron: N.A.
P26 = Socket 1x13 SMD, N.C.: Socket 1x13, 2.54mm (100mil), SMD; Manufacturer: W-CON; Manufacturer Part Number: 2171-113MS0CUNR1; Part number NEMS: 100500422; Note: N.A.; Pad Count: 13; Component Status: Active; Part Number: Socket 1x13 SMD, N.C.; Footprint Doc: SOCKET_1x13_SMD; LatestRevisionDate: 2019-05-27; Published: 2019-05-27; Value: Socket 1x13; Artikkelnr Noca: N.A.; Part number IPS: N.A.; ComponentLink1URL: N.A.; ComponentLink1Description: Datasheet; ComponentLink2URL: N.A.; ComponentLink2Description: Supplier link; HelpURL: N.A.; Supplier 1: Cabcon; Supplier Part Number 1: 2171-113MS0CUNR1; Supplier 2: Samtec; Supplier Part Number 2: SSM-113-L-SV-P-TR; Component Class: Connectors; PartId: 100500422; Author: rsk; Part number Norautron: N.A.
P27 = Pin List 1x2, N.C.: Pin List 1x2, 2.54mm (100mil); Manufacturer: N.A.; Part number NEMS: 100500298; Pad Count: 2; Component Status: Active; Part Number: Pin List 1x2, N.C.; Manufacturer Part Number: N.A.; Footprint Doc: LIST_1x2; LatestRevisionDate: 2017-02-02; Published: 2017-01-30; Value: Pin List 1x2; Note: N.A.; Artikkelnr Noca: N.A.; Part number IPS: N.A.; ComponentLink1URL: N.A.; ComponentLink1Description: Datasheet; ComponentLink2URL: N.A.; ComponentLink2Description: Supplier link; HelpURL: N.A.; Supplier 1: N.A.; Supplier Part Number 1: N.A.; Supplier 2: N.A.; Supplier Part Number 2: N.A.; Component Class: Connectors; PartId: 100500298; Author: rsk; Part number Norautron: N.A.
R62 R63 R68 = R0201-1M0: Resistor, ±1%, 0.05W; Manufacturer: N.A.; Part number IPS: 00000001418; Part number Norautron: 26107108; Part number NEMS: 100100093; Note: Chip Res 1%; Pad Count: 2; Component Status: Active; Part Number: R0201-1M0; Manufacturer Part Number: N.A.; ComponentLink1URL: N.A.; ComponentLink1Description: Datasheet; ComponentLink2URL: N.A.; ComponentLink2Description: Supplier link; HelpURL: N.A.; Footprint Doc: 0201; LatestRevisionDate: 2014-11-13; Published: 2014-11-13; Value: 1M0; Supplier 1: N.A.; Supplier Part Number 1: N.A.; Supplier 2: N.A.; Supplier Part Number 2: N.A.; Artikkelnr Noca: N.A.; Component Class: Resistors; PartId: 100100093; Author: rsk
R69 = R0201-866: Resistor, ±1%, 0.05W; Manufacturer: N.A.; Part number IPS: 00000004368; Part number NEMS: 100100042; Note: Chip Res 1%; Pad Count: 2; Component Status: Active; Part Number: R0201-866; Manufacturer Part Number: N.A.; ComponentLink1URL: N.A.; ComponentLink1Description: Datasheet; ComponentLink2URL: N.A.; ComponentLink2Description: Supplier link; HelpURL: N.A.; Footprint Doc: 0201; LatestRevisionDate: 2019-07-16; Published: 2019-07-16; Value: 866R; Artikkelnr Noca: N.A.; Supplier 1: N.A.; Supplier Part Number 1: N.A.; Supplier 2: N.A.; Supplier Part Number 2: N.A.; Component Class: Resistors; PartId: 100100042; Author: rsk; Part number Norautron: N.A.
SB32 SB47 SB59 = Solderbridge: Manufacturer: N.A.; Part number NEMS: 100500458; Pad Count: 2; Component Status: Active; Part Number: Solderbridge; Manufacturer Part Number: N.A.; Footprint Doc: Solderbridge; LatestRevisionDate: 2009-12-14; Published: 2009-12-14; Value: Solderbridge; Note: N.A.; Artikkelnr Noca: N.A.; Part number IPS: N.A.; ComponentLink1URL: N.A.; ComponentLink1Description: Datasheet; ComponentLink2URL: N.A.; ComponentLink2Description: Supplier link; HelpURL: N.A.; Supplier 1: N.A.; Supplier Part Number 1: N.A.; Supplier 2: N.A.; Supplier Part Number 2: N.A.; Component Class: Connectors; PartId: 100500458; Author: rsk; Part number Norautron: N.A.
SB33 SB60 = Solderbridge Shorted: Shorted Solderbridge; Manufacturer: N.A.; Part number NEMS: 100500459; Pad Count: 2; Component Status: Active; Part Number: Solderbridge Shorted; Manufacturer Part Number: N.A.; Footprint Doc: Solderbridge_Shorted; LatestRevisionDate: 2012-08-07; Published: 2012-08-07; Value: Solderbridge; Note: N.A.; Artikkelnr Noca: N.A.; Part number IPS: N.A.; ComponentLink1URL: N.A.; ComponentLink1Description: Datasheet; ComponentLink2URL: N.A.; ComponentLink2Description: Supplier link; HelpURL: N.A.; Supplier 1: N.A.; Supplier Part Number 1: N.A.; Supplier 2: N.A.; Supplier Part Number 2: N.A.; Component Class: Connectors; PartId: 100500459; Author: rsk; Part number Norautron: N.A.
TP9-TP12 TP17-TP19 TP31 TP42-TP47 = TP_SMD_Ø1.0MM: 1.0mm circular SMD testpad; Manufacturer: Nordic Semiconductor; Manufacturer Part Number: N.A.; Part number NEMS: 100500475; Pad Count: 1; Component Status: Active; Part Number: TP_SMD_Ø1.0MM; LatestRevisionDate: 2021-03-05; Published: 2013-06-11; Value: Ø1.0mm,SMD; Note: N.A.; Artikkelnr Noca: N.A.; Footprint Doc: TP_SMD_Ø1.0mm; Part number IPS: N.A.; ComponentLink1URL: N.A.; ComponentLink1Description: Datasheet; ComponentLink2URL: N.A.; ComponentLink2Description: Supplier link; HelpURL: N.A.; Supplier 1: N.A.; Supplier Part Number 1: N.A.; Supplier 2: N.A.; Supplier Part Number 2: N.A.; Component Class: Connectors; PartId: 100500475; Author: rsk; Part number Norautron: N.A.
TP13-TP16 = TP_SMD_Ø1.5MM: 1.5mm circular SMD testpad; Manufacturer: Nordic Semiconductor; Manufacturer Part Number: N.A.; Part number NEMS: 100500477; Pad Count: 1; Component Status: Active; Part Number: TP_SMD_Ø1.5MM; LatestRevisionDate: 2021-03-05; Published: 2016-06-02; Value: Ø1.5mm,SMD; Note: N.A.; Artikkelnr Noca: N.A.; Footprint Doc: TP_SMD_Ø1.5mm; Part number IPS: N.A.; ComponentLink1URL: N.A.; ComponentLink1Description: Datasheet; ComponentLink2URL: N.A.; ComponentLink2Description: Supplier link; HelpURL: N.A.; Supplier 1: N.A.; Supplier Part Number 1: N.A.; Supplier 2: N.A.; Supplier Part Number 2: N.A.; Component Class: Connectors; PartId: 100500477; Author: rsk; Part number Norautron: N.A.